# Altium project LIMIT_SW_Breakout.PrjPCB
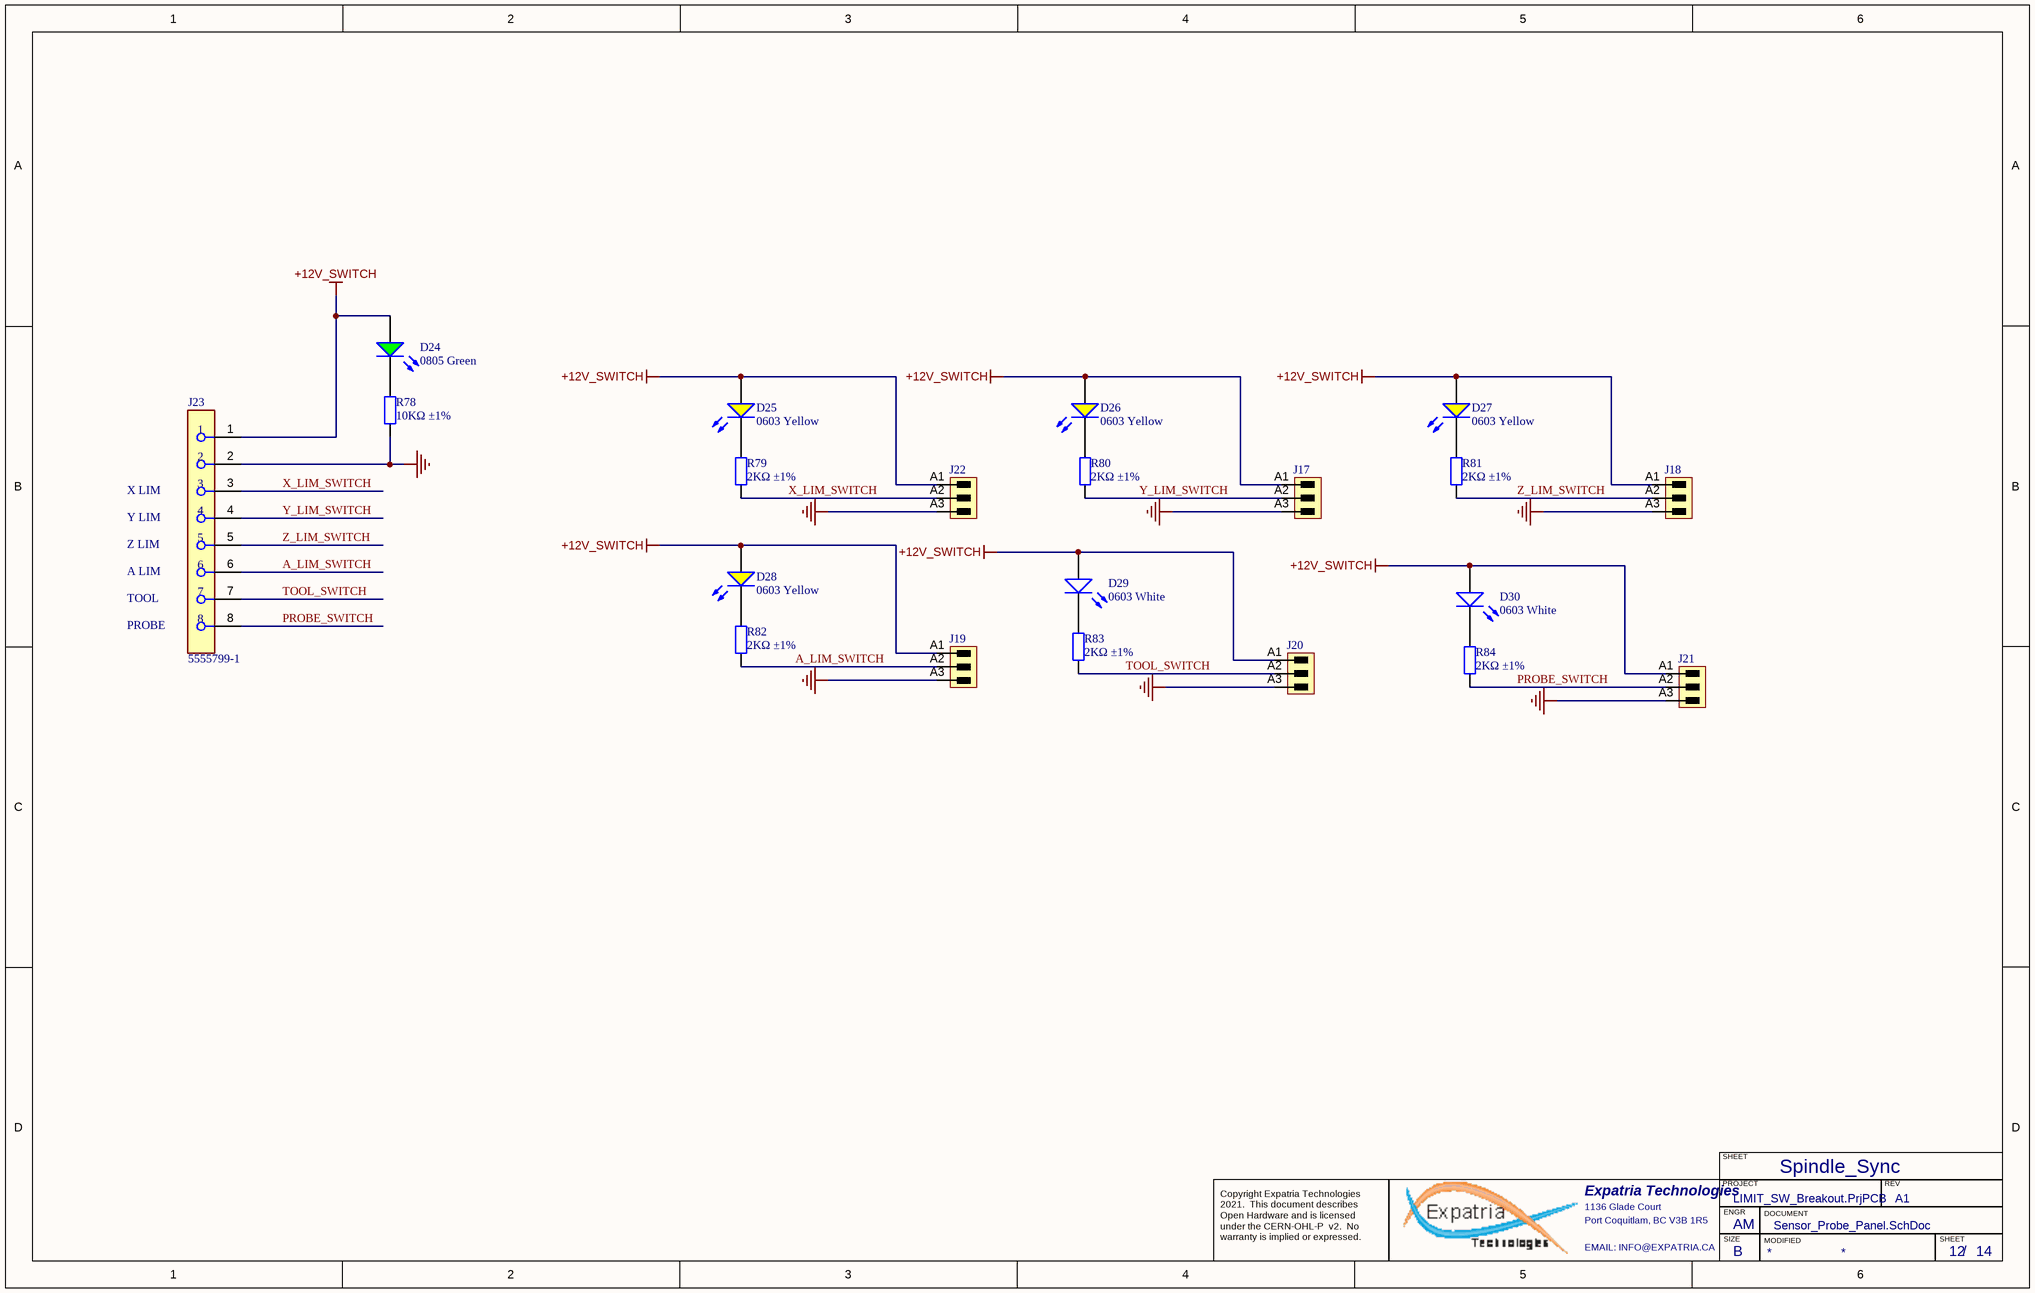
[diagram p0: Sensor_Probe_Panel.SchDoc]
PCBPARTNO: GRBLHAL_2000_EST; PCBREVNO: A6; Title: GRBLHAL_2000_EST; VarRevNo: A6
1 sheet, 21 parts. Net scope: hierarchical (ports join the sheet entries above them; power ports are global).
Board file: LIMIT_SW_Breakout.pcbdoc

## Sheet Sensor_Probe_Panel.SchDoc: GRBLHAL_2000_EST
size B; Author: AM; CompanyName: Expatria Technologies; DrawnBy: A.Marles; Engineer: AM; Organization: Expatria Technologies; DocumentNumber: 12; Revision: A1; SheetNumber: 12; SheetTotal: 14; PCB_Rev: A1

### Parts
D24  0805 Green  [0805_LED_S1]
D25  0603 Yellow  [0603_LED_S1]
D26  0603 Yellow  [0603_LED_S1]
D27  0603 Yellow  [0603_LED_S1]
D28  0603 Yellow  [0603_LED_S1]
D29  0603 White  [0603_LED_S1]
D30  0603 White  [0603_LED_S1]
J17  (no value)  [SL_3_50_180G_03]
J18  (no value)  [SL_3_50_180G_03]
J19  (no value)  [SL_3_50_180G_03]
J20  (no value)  [SL_3_50_180G_03]
J21  (no value)  [SL_3_50_180G_03]
J22  (no value)  [SL_3_50_180G_03]
J23  5555799-1  [FP-5555799-1-MFG]
R78  10KΩ ±1%  [0603_R]
R79  2KΩ ±1%  [0603_R]
R80  2KΩ ±1%  [0603_R]
R81  2KΩ ±1%  [0603_R]
R82  2KΩ ±1%  [0603_R]
R83  2KΩ ±1%  [0603_R]
R84  2KΩ ±1%  [0603_R]

### Nets
+12V_SWITCH: D24.A D25.A D26.A D27.A D28.A D29.A D30.A J17.A1 J18.A1 J19.A1 J20.A1 J21.A1 J22.A1 J23.1
GND_SWITCH: J17.A3 J18.A3 J19.A3 J20.A3 J21.A3 J22.A3 J23.2 R78.1
A_LIM_SWITCH: J19.A2 J23.6 R82.2
PROBE_SWITCH: J21.A2 J23.8 R84.2
TOOL_SWITCH: J20.A2 J23.7 R83.2
X_LIM_SWITCH: J22.A2 J23.3 R79.2
Y_LIM_SWITCH: J17.A2 J23.4 R80.2
Z_LIM_SWITCH: J18.A2 J23.5 R81.2
NetD24_K: D24.K R78.2
NetD25_K: D25.K R79.1
NetD26_K: D26.K R80.1
NetD27_K: D27.K R81.1
NetD28_K: D28.K R82.1
NetD29_K: D29.K R83.1
NetD30_K: D30.K R84.1

### Notes on the sheet
- X LIM
- Y LIM
- Z LIM
- A LIM
- TOOL
- PROBE
- Spindle_Sync
- SHEET
- Expatria Technologies
- 1136 Glade Court
- Port Coquitlam, BC V3B 1R5
- PROJECT
- SIZE
- ENGR
- MODIFIED
- DOCUMENT
- REV
- Copyright Expatria Technologies 2021.  This document describes Open Hardware and is licensed under the CERN-OHL-P  v2.  No warranty is implied or expressed.
- EMAIL: INFO@EXPATRIA.CA
- B
- /

### Library data of the parts
D24 = 0805 LED Green: LED; Package: 0805; Supplier: LC; SuppliersPartNumber: C2297; Color: Green
D25-D28 = 0603 LED Yellow: LED; Package: 0603; Supplier: LC; SuppliersPartNumber: C72038; Color: Yellow
D29 D30 = 0603 LED White: LED; Package: 0603; Supplier: LC; SuppliersPartNumber: C2290; Color: White
J17-J22 = CMP-1559-00904-1: Header,Male Pin,Covered(4 Sided) 3 1 0.138"（3.50mm） 3 P=3.5mm Pluggable System Terminal Block RoHS; PartNumber: WJ15EDGVC-3.5-3P; Manufacturer: Ningbo Kangnex Elec; Pitch_mm: 3.5 mm; UL_94_flammability_rating: V-0; Side_termination_characteristic: closed side; Solder_pin_length_mm: 3.2 mm; Short_text_for_material: SL 3.50/03/180G 3.2SN OR BX; Pitch_inch: 0.138 inch; PackageReference: SL_3_50_180G_03; Packaging: Box; Revision: V1; SuppliersPartNumber: C192778
J23 = CMP-03371-000003-1: CONN MOD JACK 8P8C VERT UNSHLD; Manufacturer: TE Connectivity; Pitch: 2.54mm; Number Of Contacts: 8; Is Female: yes; Device Class L3: unset; Manufacturer Part Number: 5555799-1; Temperature Range High: +85°C; Temperature Range Low: -40°C; Octopart: https://octopart.com/5555799-1-te+connectivity-39526335; Device Class L1: Connectors; Device Class L2: Modular / Ethernet Connectors; Mouser Description: Conn RJ-45 F 8 POS 2.54mm Solder ST Thru-Hole 8 Terminal 1 Port Cat 3 Box/Package/Tray; Digikey Description: CONN MOD JACK 8P8C VERT UNSHLD; Package: 5555799-1; Temperature: -40°C to +85°C; SuppliersPartNumber: C305983
R78 = 0603 10K (1002) 1%: Chip resistor; Manufacturer: Uniroyal Elec; PartNumber: 0603WAF1002T5E; Power: 1/10W; Package: 0603; Supplier: LC; SuppliersPartNumber: C25804; Resistance: 10KΩ; Tolerance: 1%; ComponentLink1Description: Supplier link; ComponentLink1URL: http://www.szlcsc.com/product/details_26547.html
R79-R84 = 0603 2K (2001) 1%: Chip resistor; Manufacturer: Uniroyal Elec; PartNumber: 0603WAF2001T5E; Power: 1/10W; Package: 0603; Supplier: LC; SuppliersPartNumber: C22975; Resistance: 2KΩ; Tolerance: 1%; ComponentLink1Description: Supplier link; ComponentLink1URL: http://www.szlcsc.com/product/details_23702.html

## Assembly variants
SMT_ONLY: not fitted A1 J1 J2 J3 J4 J5 J6 J7 J8 J9 J10 J11 J12 J13 J14 J15 J16 J17 J18 J19 J20 J21 J22 J22 J23 J23 J24 J25 J26 J27 J28 L3 P1 P2 P3 P4 P5 P6 P7 P8 P9 P10 P11 P12 P12 P13 P13 P14 P14 P15 P15 P16 P16 P16 P17 P17 P18 P18 P19 P19 R76 U15 VR2
FULL_ASSEMBLY: not fitted J? J? J? J? R76 U15